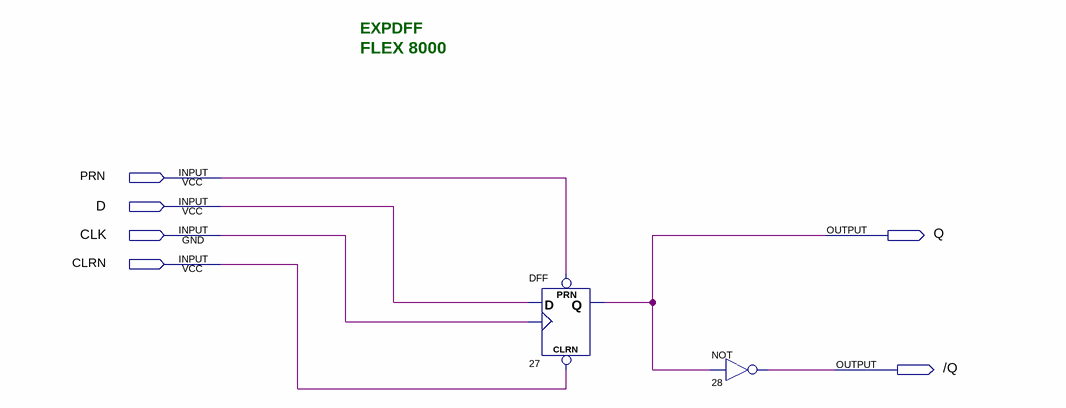
[diagram p0: schematic sheet]
// Quartus schematic fexpdff.bdf as structural Verilog: 2 symbols, 6 pins
module fexpdff (
  input  PRN,
  input  D,
  input  CLK,
  input  CLRN,
  output Q,
  output \/Q 
);

  DFF u_27 (.CLRN(CLRN), .CLK(CLK), .D(D), .PRN(PRN), .Q(Q));
  not u_28 (\/Q , Q);

  // Notes on the sheet:
  //   EXPDFF
  //   FLEX 8000
endmodule
